# Altium project SW-RPi-CM3.PrjPcb
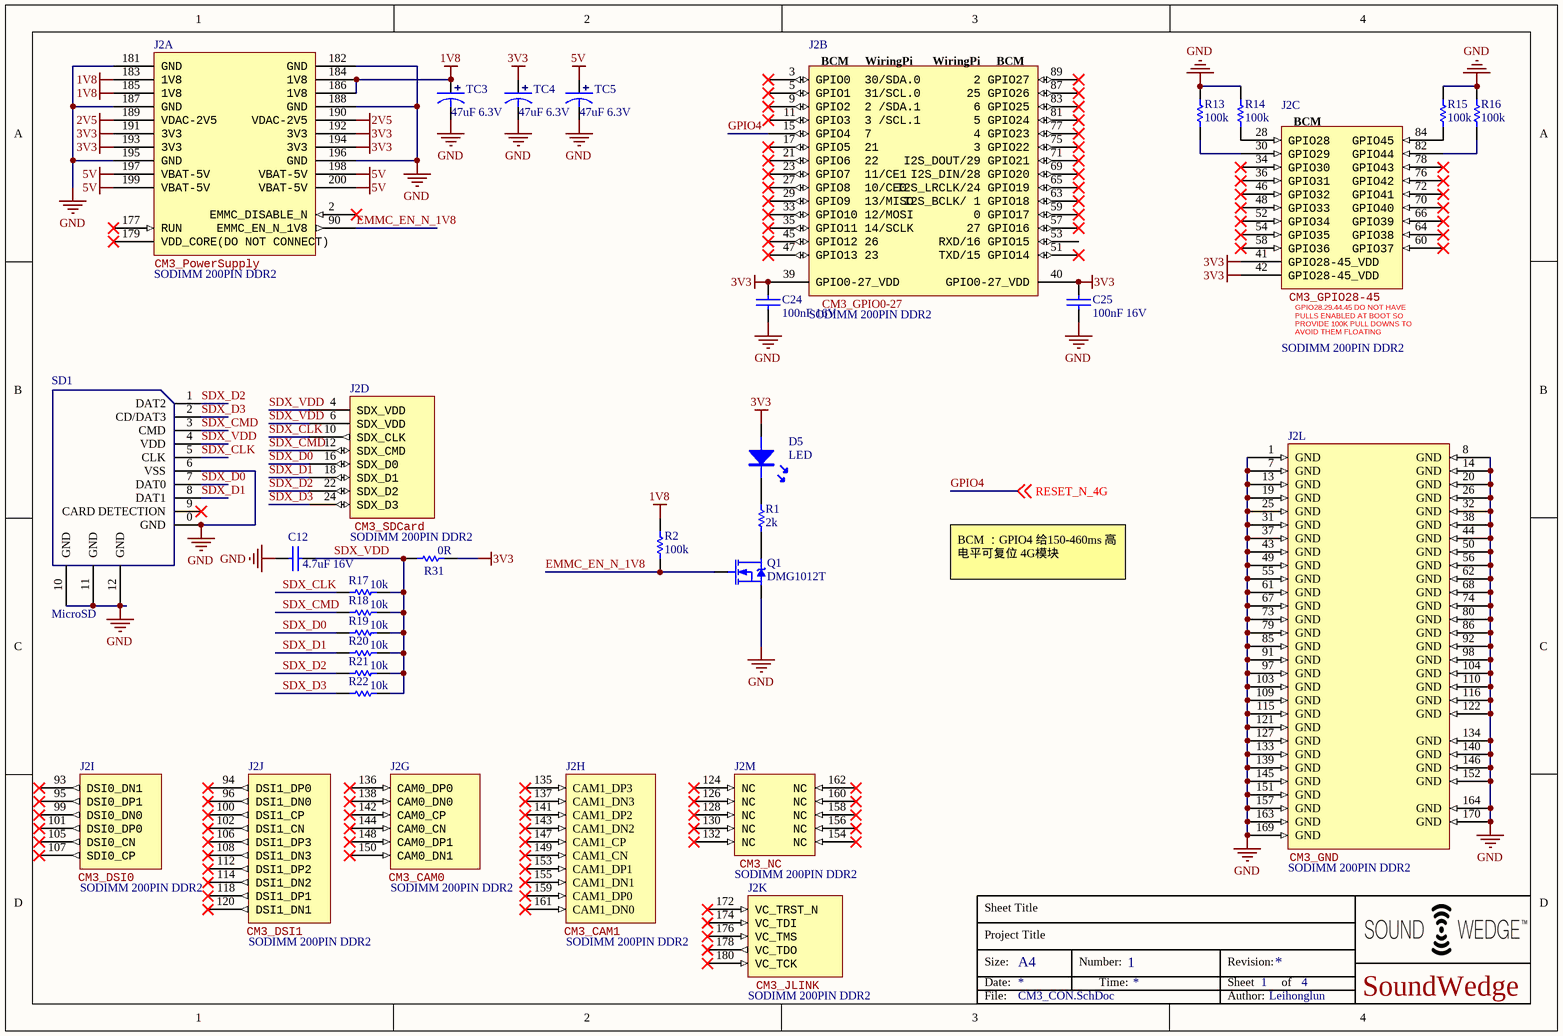
[diagram p0: CM3_CON.SchDoc]
PCB_Author: Author; PCB_Revision: V0I0; Project_Name: Templates Project; SCH_Author: LeiHongLun; SCH_Revision: V0I0; SCH_SheetTotal: 16
4 sheets, 83 parts. Net scope: global (net labels, ports and power ports of the same name join across sheets).
Board file: CM3_Board.PcbDoc
Sheets:
  CM3_CON.SchDoc
  CM3_HDMI.SchDoc
  CM3_Power.SchDoc
  CM3_USBHub.SchDoc

## Sheet CM3_CON.SchDoc: =DocumentName
size A4; Author: Leihonglun; CompanyName: SoundWedge; DocumentNumber: 1; SheetNumber: 1; SheetTotal: 4; SheetTitle: CM3_CON.SchDoc; ProjectTitle: SW-RPi-CM3.PrjPcb

### Parts
C12  4.7uF 16V  [0402C]
C24  100nF 16V  [0402C]
C25  100nF 16V  [0402C]
D5  LED  [LED-0603G]
J2  SODIMM 200PIN DDR2  [SODIMM 200PIN - 5.2H]  (parts A,B,C,D,G,H,I,J,K,L,M of 13)
Q1  DMG1012T  [SOT523]
R1  2k  [0402R]
R2  100k  [0402R]
R13  100k  [0402R]
R14  100k  [0402R]
R15  100k  [0402R]
R16  100k  [0402R]
R17  10k  [0402R]
R18  10k  [0402R]
R19  10k  [0402R]
R20  10k  [0402R]
R21  10k  [0402R]
R22  10k  [0402R]
R31  0R  [0402R]
SD1  MicroSD  [Micro SD]
TC3  47uF 6.3V  [TAJ-A/3216]
TC4  47uF 6.3V  [TAJ-A/3216]
TC5  47uF 6.3V  [TAJ-A/3216]

### Nets
1V8: J2.183(1V8) J2.184(1V8) J2.185(1V8) J2.186(1V8) R2.2 TC3.1
2V5: J2.189(VDAC-2V5) J2.190(VDAC-2V5)
3V3: C24.2 C25.2 D5.A J2.39(GPIO0-27_VDD) J2.40(GPIO0-27_VDD) J2.41(GPIO28-45_VDD) J2.42(GPIO28-45_VDD) J2.191(3V3) J2.192(3V3) J2.193(3V3) J2.194(3V3) R31.2 TC4.1
5V: J2.197(VBAT-5V) J2.198(VBAT-5V) J2.199(VBAT-5V) J2.200(VBAT-5V) TC5.1
GND: C12.1 C24.1 C25.1 J2.1(GND) J2.7(GND) J2.8(GND) J2.13(GND) J2.14(GND) J2.19(GND) J2.20(GND) J2.25(GND) J2.26(GND) J2.31(GND) J2.32(GND) J2.37(GND) J2.38(GND) J2.43(GND) J2.44(GND) J2.49(GND) J2.50(GND) J2.55(GND) J2.56(GND) J2.61(GND) J2.62(GND) J2.67(GND) J2.68(GND) J2.73(GND) J2.74(GND) J2.79(GND) J2.80(GND) J2.85(GND) J2.86(GND) J2.91(GND) J2.92(GND) J2.97(GND) J2.98(GND) J2.103(GND) J2.104(GND) J2.109(GND) J2.110(GND) J2.115(GND) J2.116(GND) J2.121(GND) J2.122(GND) J2.127(GND) J2.133(GND) J2.134(GND) J2.139(GND) J2.140(GND) J2.145(GND) J2.146(GND) J2.151(GND) J2.152(GND) J2.157(GND) J2.163(GND) J2.164(GND) J2.169(GND) J2.170(GND) J2.181(GND) J2.182(GND) J2.187(GND) J2.188(GND) J2.195(GND) J2.196(GND) Q1.S R13.2 R14.2 R15.2 R16.2 SD1.0(GND) SD1.6(VSS) SD1.10(GND) SD1.11(GND) SD1.12(GND) TC3.2 TC4.2 TC5.2
EMMC_EN_N_1V8: J2.90(EMMC_EN_N_1V8) Q1.G R2.1
GPIO4: J2.15(GPIO4__7) ; off-sheet RESET_N_4G  [also labelled RESET_N_4G]
SDX_CLK: J2.10(SDX_CLK) R17.1 SD1.5(CLK)
SDX_CMD: J2.12(SDX_CMD) R18.1 SD1.3(CMD)
SDX_D0: J2.16(SDX_D0) R19.1 SD1.7(DAT0)
SDX_D1: J2.18(SDX_D1) R20.1 SD1.8(DAT1)
SDX_D2: J2.22(SDX_D2) R21.1 SD1.1(DAT2)
SDX_D3: J2.24(SDX_D3) R22.1 SD1.2(CD/DAT3)
SDX_VDD: C12.2 J2.4(SDX_VDD) J2.6(SDX_VDD) R17.2 R18.2 R19.2 R20.2 R21.2 R22.2 R31.1 SD1.4(VDD)
NetD5_K: D5.K R1.1
NetJ2_28: J2.28(GPIO28) R14.1
NetJ2_30: J2.30(GPIO29) R13.1
NetJ2_82: J2.82(GPIO44) R16.1
NetJ2_84: J2.84(GPIO45) R15.1
NetQ1_D: Q1.D R1.2

Not connected (* = marked no-connect by the designer): J2 2(EMMC_DISABLE_N)* 3(GPIO0__30/SDA.0)* 5(GPIO1__31/SCL.0)* 9(GPIO2__2_/SDA.1)* 11(GPIO3__3_/SCL.1)* 17(GPIO5__21)* 21(GPIO6__22)* 23(GPIO7__11/CE1)* 27(GPIO8__10/CE0)* 29(GPIO9__13/MISO)* 33(GPIO10_12/MOSI)* 34(GPIO30)* 35(GPIO11_14/SCLK)* 36(GPIO31)* 45(GPIO12_26)* 46(GPIO32)* 47(GPIO13_23)* 48(GPIO33)* 51(TXD/15_GPIO14)* 52(GPIO34)* 53(RXD/16_GPIO15) 54(GPIO35)* 57(27_GPIO16)* 58(GPIO36)* 59(0_GPIO17)* 60(GPIO37)* 63(I2S_BCLK/_1_GPIO18)* 64(GPIO38)* 65(I2S_LRCLK/24_GPIO19)* 66(GPIO39)* 69(I2S_DIN/28_GPIO20)* 70(GPIO40)* 71(I2S_DOUT/29_GPIO21)* 72(GPIO41)* 75(3_GPIO22)* 76(GPIO42)* 77(4_GPIO23)* 78(GPIO43)* 81(5_GPIO24)* 83(6_GPIO25)* 87(25_GPIO26)* 89(2_GPIO27)* 93(DSI0_DN1)* 94(DSI1_DP0)* 95(DSI0_DP1)* 96(DSI1_DN0)* 99(DSI0_DN0)* 100(DSI1_CP)* 101(DSI0_DP0)* 102(DSI1_CN)* 105(DSI0_CN)* 106(DSI1_DP3)* 107(SDI0_CP)* 108(DSI1_DN3)* 112(DSI1_DP2)* 114(DSI1_DN2)* 118(DSI1_DP1)* 120(DSI1_DN1)* 124(NC)* 126(NC)* 128(NC)* 130(NC)* 132(NC)* 135(CAM1_DP3)* 136(CAM0_DP0)* 137(CAM1_DN3)* 138(CAM0_DN0)* 141(CAM1_DP2)* 142(CAM0_CP)* 143(CAM1_DN2)* 144(CAM0_CN)* 147(CAM1_CP)* 148(CAM0_DP1)* 149(CAM1_CN)* 150(CAM0_DN1)* 153(CAM1_DP1)* 154(NC)* 155(CAM1_DN1)* 156(NC)* 158(NC)* 159(CAM1_DP0)* 160(NC)* 161(CAM1_DN0)* 162(NC)* 172(VC_TRST_N)* 174(VC_TDI)* 176(VC_TMS)* 177(RUN)* 178(VC_TDO)* 179(VDD_CORE(DO_NOT_CONNECT))* 180(VC_TCK)*; SD1 9(CARD_DETECTION)*

### Notes on the sheet
- BCM ：GPIO4 给150-460ms 高电平可复位 4G模块
- Sheet Title
- Project Title
- Size:
- Date:
- A4
- Number:
- Time:
- Revision:
- Sheet
- of
- File:
- Author:
- (in symbol RPi-CM3, part A) CM3_PowerSupply
- (in symbol RPi-CM3, part B) BCM; WiringPi; CM3_GPIO0-27
- (in symbol RPi-CM3, part C) BCM; CM3_GPIO28-45; GPIO28.29.44.45 DO NOT HAVE PULLS ENABLED AT BOOT SO PROVIDE 100K PULL DOWNS TO AVOID THEM FLOATING
- (in symbol RPi-CM3, part D) CM3_SDCard
- (in symbol RPi-CM3, part G) CM3_CAM0
- (in symbol RPi-CM3, part H) CM3_CAM1
- (in symbol RPi-CM3, part I) CM3_DSI0
- (in symbol RPi-CM3, part J) CM3_DSI1
- (in symbol RPi-CM3, part K) CM3_JLINK
- (in symbol RPi-CM3, part L) CM3_GND
- (in symbol RPi-CM3, part M) CM3_NC

### Library data of the parts
C12 C24 C25 = CAP-NP
D5 = LED: 绿色
J2 = RPi-CM3
Q1 = N-MOS: N沟道场效应管
R1 R2 R13-R22 R31 = RES
SD1 = MicroSD: 佐田¦(自弹)TF卡座 micro sd卡座; ComponentLink1Description: taobao.com; ComponentLink1URL: https://detail.tmall.com/item.htm?id=44131369945&spm=a1z09.2.0.0.73b72e8dl9KedD&_u=am2gus40e9e
TC3-TC5 = TCAP

## Sheet CM3_HDMI.SchDoc
size A4; DocumentNumber: 2; SheetNumber: 2; SheetTotal: 4; SheetTitle: CM3_HDMI.SchDoc; ProjectTitle: SW-RPi-CM3.PrjPcb
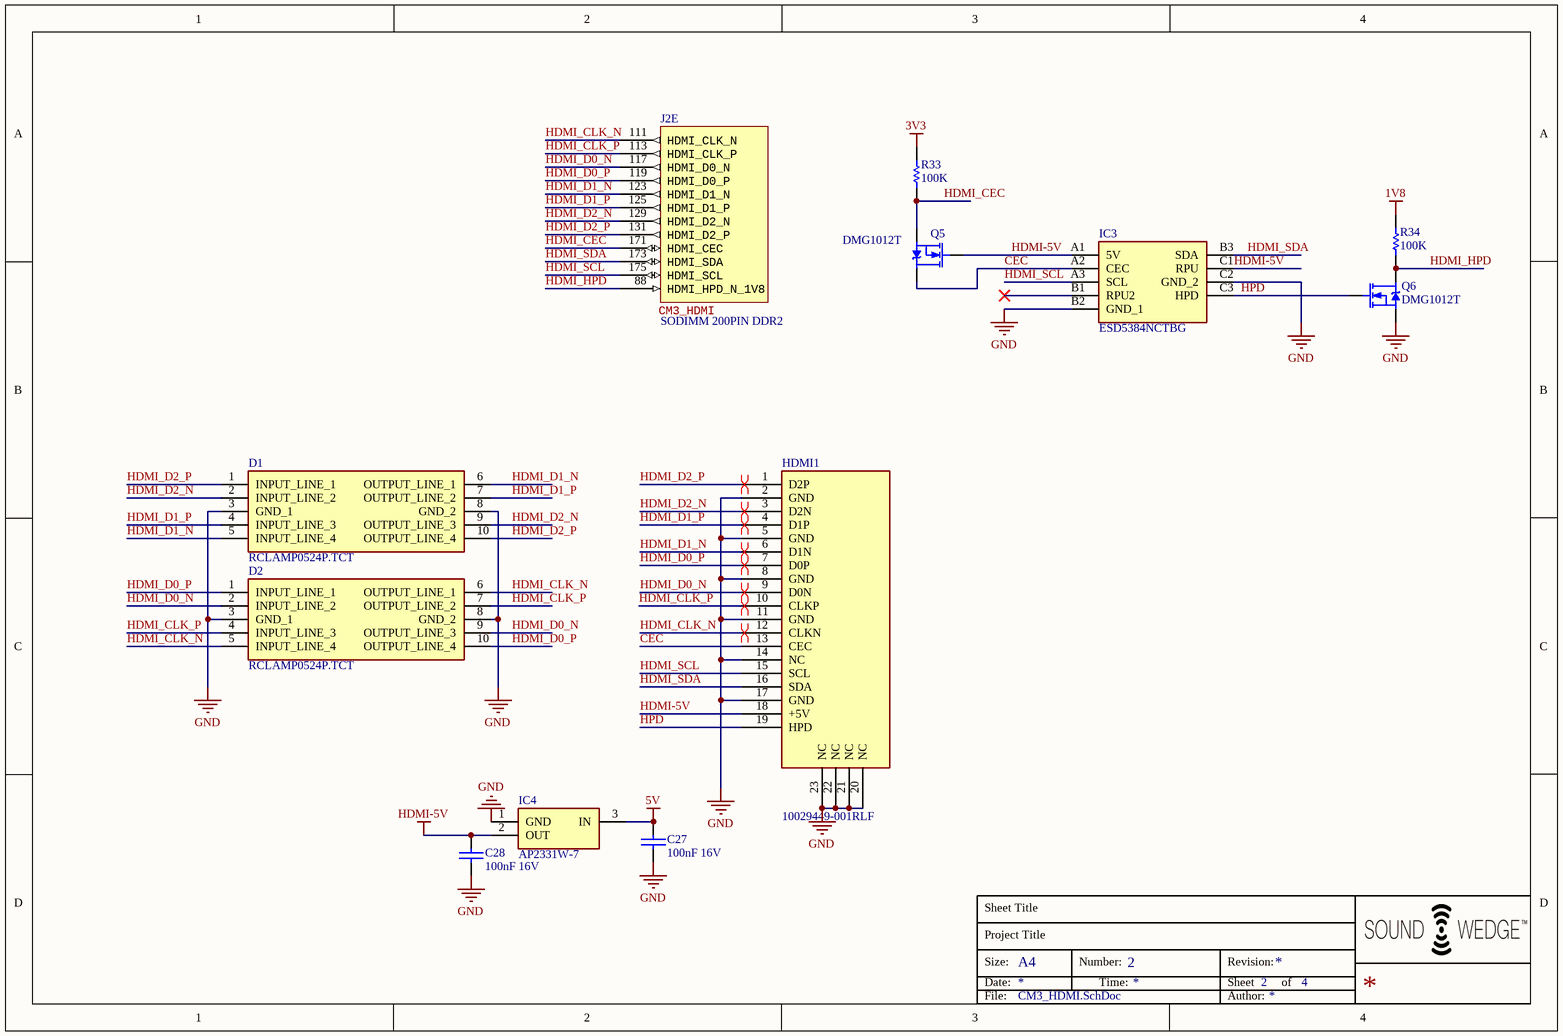
[diagram p1: CM3_HDMI.SchDoc]

### Parts
C27  100nF 16V  [0402C]
C28  100nF 16V  [0402C]
D1  RCLAMP0524P.TCT  [RCLAMP0524P]
D2  RCLAMP0524P.TCT  [RCLAMP0524P]
HDMI1  10029449-001RLF  [HDMI-001]
IC3  ESD5384NCTBG  [BGA9C40P3X3_114X114X63]
IC4  AP2331W-7  [SOT95P285X130-3N]
J2  SODIMM 200PIN DDR2  [SODIMM 200PIN - 5.2H]  (part E of 13)
Q5  DMG1012T  [SOT523]
Q6  DMG1012T  [SOT523]
R33  100K  [0402R]
R34  100K  [0402R]

### Nets
1V8: R34.2
3V3: R33.2
5V: C27.1 IC4.3(IN)
GND: C27.2 C28.2 D1.3(GND_1) D1.8(GND_2) D2.3(GND_1) D2.8(GND_2) HDMI1.2(GND) HDMI1.5(GND) HDMI1.8(GND) HDMI1.11(GND) HDMI1.14(NC) HDMI1.17(GND) HDMI1.20(NC) HDMI1.21(NC) HDMI1.22(NC) HDMI1.23(NC) IC3.B2(GND_1) IC3.C2(GND_2) IC4.1(GND) Q6.S
HDMI-5V: C28.1 HDMI1.18(+5V) IC3.A1(5V) IC3.C1(RPU) IC4.2(OUT) Q5.G
CEC: HDMI1.13(CEC) IC3.A2(CEC) Q5.D
HDMI_CEC: J2.171(HDMI_CEC) Q5.S R33.1
HDMI_CLK_N: D2.5(INPUT_LINE_4) D2.6(OUTPUT_LINE_1) HDMI1.12(CLKN) J2.111(HDMI_CLK_N)
HDMI_CLK_P: D2.4(INPUT_LINE_3) D2.7(OUTPUT_LINE_2) HDMI1.10(CLKP) J2.113(HDMI_CLK_P)
HDMI_D0_N: D2.2(INPUT_LINE_2) D2.9(OUTPUT_LINE_3) HDMI1.9(D0N) J2.117(HDMI_D0_N)
HDMI_D0_P: D2.1(INPUT_LINE_1) D2.10(OUTPUT_LINE_4) HDMI1.7(D0P) J2.119(HDMI_D0_P)
HDMI_D1_N: D1.5(INPUT_LINE_4) D1.6(OUTPUT_LINE_1) HDMI1.6(D1N) J2.123(HDMI_D1_N)
HDMI_D1_P: D1.4(INPUT_LINE_3) D1.7(OUTPUT_LINE_2) HDMI1.4(D1P) J2.125(HDMI_D1_P)
HDMI_D2_N: D1.2(INPUT_LINE_2) D1.9(OUTPUT_LINE_3) HDMI1.3(D2N) J2.129(HDMI_D2_N)
HDMI_D2_P: D1.1(INPUT_LINE_1) D1.10(OUTPUT_LINE_4) HDMI1.1(D2P) J2.131(HDMI_D2_P)
HDMI_HPD: J2.88(HDMI_HPD_N_1V8) Q6.D R34.1
HDMI_SCL: HDMI1.15(SCL) IC3.A3(SCL) J2.175(HDMI_SCL)
HDMI_SDA: HDMI1.16(SDA) IC3.B3(SDA) J2.173(HDMI_SDA)
HPD: HDMI1.19(HPD) IC3.C3(HPD) Q6.G

Not connected (* = marked no-connect by the designer): IC3 B1(RPU2)*

### Layout directives
differential pair: HDMI_CLK_N, HDMI_CLK_P, HDMI_D0_N, HDMI_D0_P, HDMI_D1_N, HDMI_D1_P, HDMI_D2_N, HDMI_D2_P

### Notes on the sheet
- Sheet Title
- Project Title
- Size:
- Date:
- A4
- Number:
- Time:
- Revision:
- Sheet
- of
- File:
- Author:
- (in symbol RPi-CM3, part E) CM3_HDMI

### Library data of the parts
C27 C28 = CAP
D1 D2 = RCLAMP0524P.TCT: Diode; Manufacturer_Name: SEMTECH; Datasheet Link: http://www.semtech.com/images/datasheet/rclamp0522p_0524p.pdf; Manufacturer_Part_Number: RCLAMP0524P.TCT; Arrow Part Number: RCLAMP0524P.TCT; Arrow Price/Stock: https://www.arrow.com/en/products/rclamp0524p.tct/semtech; Mouser Part Number: 947-RCLAMP0524P.TCT; Mouser Price/Stock: https://www.mouser.co.uk/ProductDetail/Semtech/RCLAMP0524PTCT?qs=rBWM4%252BvDhIdgSxIzr%252B4z8Q%3D%3D
HDMI1 = 10029449-001RLF: HDMI Connector; Manufacturer_Name: Amphenol; Allied_Number: 70247646; Datasheet Link: https://cdn.amphenol-icc.com/media/wysiwyg/files/drawing/10029449.pdf; Height: 6.3mm; Manufacturer_Part_Number: 10029449-001RLF; Mouser Part Number: 649-10029449-001RLF; Mouser Price/Stock: https://www.mouser.com/Search/Refine.aspx?Keyword=649-10029449-001RLF; RS Part Number: 7710094; RS Price/Stock: http://uk.rs-online.com/web/p/products/7710094; Allied Price/Stock: https://www.alliedelec.com/amphenolicc-10029449-001rlf/70247646/
IC3 = ESD5384NCTBG: Integrated Circuit; Manufacturer_Name: ON Semiconductor; Allied_Number: 70466034; Datasheet Link: http://www.onsemi.com/pub/Collateral/ESD5384-D.PDF; Height: 0.63mm; Manufacturer_Part_Number: ESD5384NCTBG; Mouser Part Number: 863-ESD5384NCTBG; Mouser Price/Stock: https://www.mouser.com/Search/Refine.aspx?Keyword=863-ESD5384NCTBG; RS Part Number: 8010213P; RS Price/Stock: http://uk.rs-online.com/web/p/products/8010213P; Allied Price/Stock: http://www.alliedelec.com/on-semiconductor-esd5384nctbg/70466034/
IC4 = AP2331W-7: Integrated Circuit; Manufacturer_Name: Diodes Inc.; Datasheet Link: https://componentsearchengine.com/Datasheets/1/AP2331W-7.pdf; Height: 1.3mm; Manufacturer_Part_Number: AP2331W-7; Mouser Part Number: 621-AP2331W-7; Mouser Price/Stock: https://www.mouser.com/Search/Refine.aspx?Keyword=621-AP2331W-7; RS Part Number: 8287665P; RS Price/Stock: http://uk.rs-online.com/web/p/products/8287665P
J2 = RPi-CM3
Q5 Q6 = N-MOS: N沟道场效应管
R33 R34 = RES

## Sheet CM3_Power.SchDoc: =DocumentName
size A4; Author: Leihonglun; CompanyName: SoundWedge; DocumentNumber: 3; SheetNumber: 3; SheetTotal: 4; SheetTitle: CM3_Power.SchDoc; ProjectTitle: SW-RPi-CM3.PrjPcb
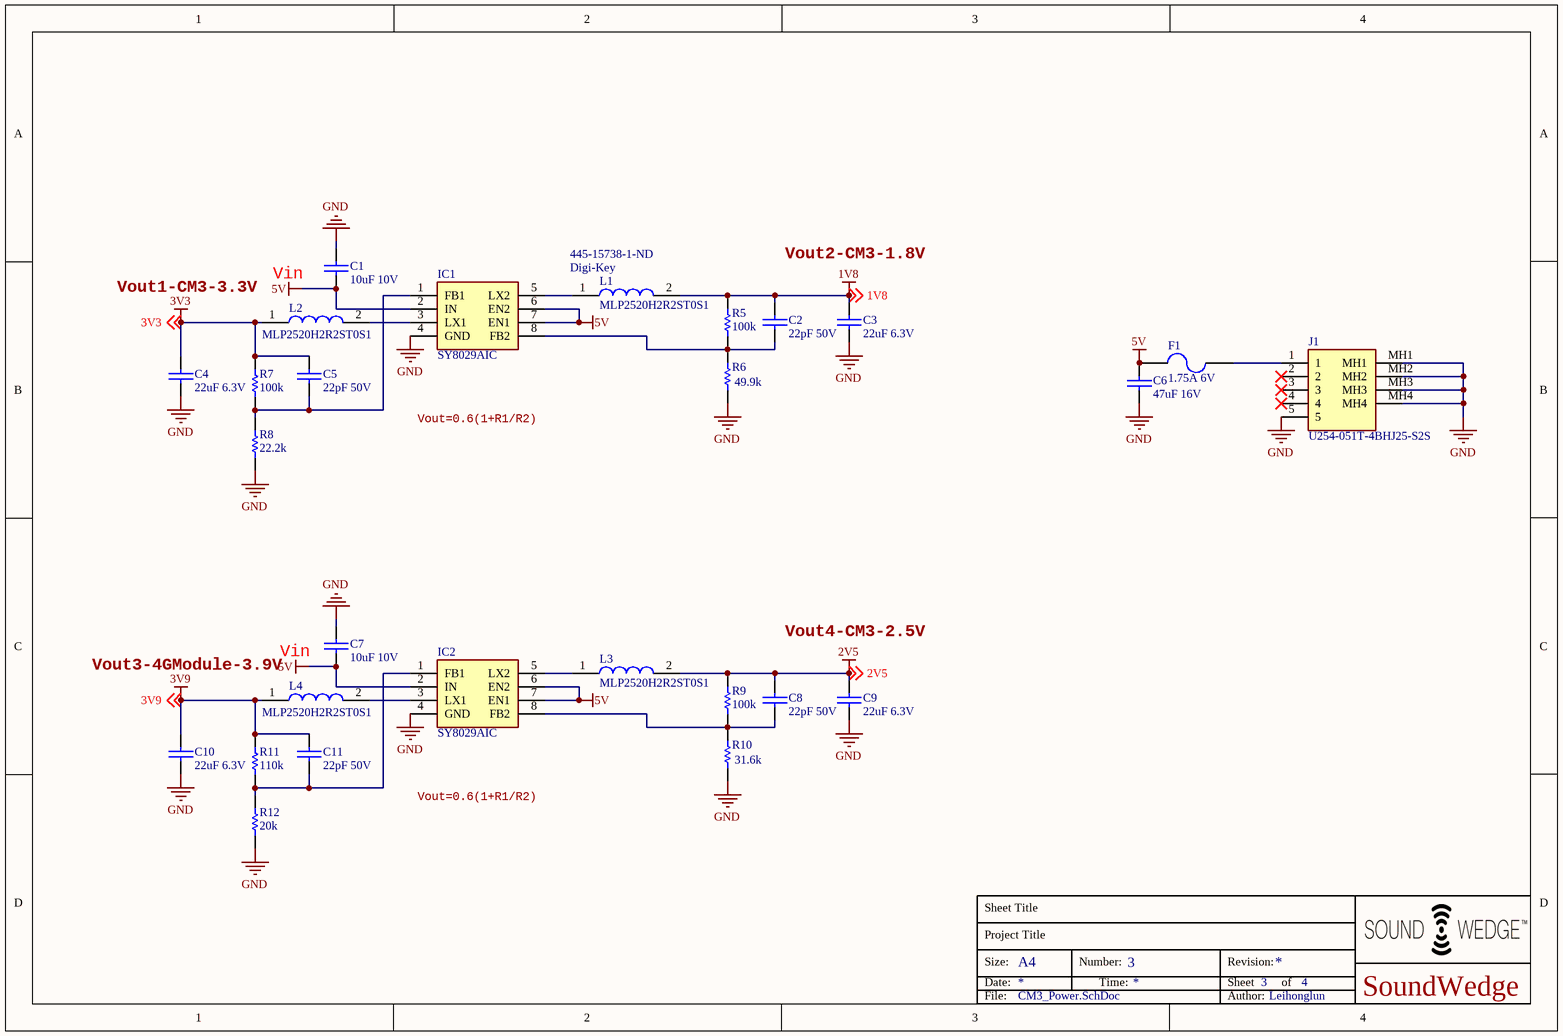
[diagram p2: CM3_Power.SchDoc]

### Parts
C1  10uF 10V  [0805C]
C2  22pF 50V  [0402C]
C3  22uF 6.3V  [0603C]
C4  22uF 6.3V  [0603C]
C5  22pF 50V  [0402C]
C6  47uF 16V  [1210C]
C7  10uF 10V  [0805C]
C8  22pF 50V  [0402C]
C9  22uF 6.3V  [0603C]
C10  22uF 6.3V  [0603C]
C11  22pF 50V  [0402C]
F1  1.75A 6V  [FUSE-1210]
IC1  SY8029AIC  [SOT65P280X110-8N]
IC2  SY8029AIC  [SOT65P280X110-8N]
J1  U254-051T-4BHJ25-S2S  [U254051T4BHJ25S2S]
L1  MLP2520H2R2ST0S1  Supplier 1: Digi-Key  Supplier Part Number 1: 445-15738-1-ND  [INDC2520X100N]
L2  MLP2520H2R2ST0S1  [INDC2520X100N]
L3  MLP2520H2R2ST0S1  [INDC2520X100N]
L4  MLP2520H2R2ST0S1  [INDC2520X100N]
R5  100k  [0402R]
R6  49.9k  [0402R]
R7  100k  [0402R]
R8  22.2k  [0402R]
R9  100k  [0402R]
R10  31.6k  [0402R]
R11  110k  [0402R]
R12  20k  [0402R]

### Nets
1V8: C2.2 C3.2 L1.2 R5.2 ; off-sheet 1V8
2V5: C8.2 C9.2 L3.2 R9.2 ; off-sheet 2V5
3V3: C4.2 C5.2 L2.1 R7.2 ; off-sheet 3V3
3V9: C10.2 C11.2 L4.1 R11.2 ; off-sheet 3V9
5V: C1.1 C6.2 C7.1 F1.1 IC1.2(IN) IC1.6(EN2) IC1.7(EN1) IC2.2(IN) IC2.6(EN2) IC2.7(EN1)
GND: C1.2 C3.1 C4.1 C6.1 C7.2 C9.1 C10.1 IC1.4(GND) IC2.4(GND) J1.5 J1.MH1 J1.MH2 J1.MH3 J1.MH4 R6.1 R8.1 R10.1 R12.1
NetC2_1: C2.1 IC1.8(FB2) R5.1 R6.2
NetC5_1: C5.1 IC1.1(FB1) R7.1 R8.2
NetC8_1: C8.1 IC2.8(FB2) R9.1 R10.2
NetC11_1: C11.1 IC2.1(FB1) R11.1 R12.2
NetF1_2: F1.2 J1.1
NetIC1_3: IC1.3(LX1) L2.2
NetIC1_5: IC1.5(LX2) L1.1
NetIC2_3: IC2.3(LX1) L4.2
NetIC2_5: IC2.5(LX2) L3.1

Not connected (* = marked no-connect by the designer): J1 2* 3* 4*

### Notes on the sheet
- Vout2-CM3-1.8V
- Vout1-CM3-3.3V
- Vin
- Vout=0.6(1+R1/R2)
- (near L4) Vout3-4GModule-3.9V
- Vout4-CM3-2.5V
- Sheet Title
- Project Title
- Size:
- Date:
- A4
- Number:
- Time:
- Revision:
- Sheet
- of
- File:
- Author:

### Library data of the parts
C1-C11 = CAP-NP
F1 = FUSE
IC1 IC2 = SY8029AIC: Integrated Circuit; Manufacturer_Name: Silergy Corp; Datasheet Link: https://datasheet.lcsc.com/szlcsc/Silergy-Corp-SY8029AIC_C207636.pdf; Height: 1.1mm; Manufacturer_Part_Number: SY8029AIC
J1 = U254-051T-4BHJ25-S2S: Connector; Manufacturer_Name: XKB Enterprise; Datasheet Link: https://datasheet.lcsc.com/szlcsc/2002271812_XKB-Enterprise-U254-051T-4BHJ25-S2S_C319163.pdf; Height: 2.9mm; Manufacturer_Part_Number: U254-051T-4BHJ25-S2S
L1-L4 = MLP2520K1R0MT0S1: Inductor; Manufacturer_Name: TDK; Datasheet Link: https://www.arrow.com/en/products/mlp2520k1r0mt0s1/tdk; Height: 1mm; Manufacturer_Part_Number: MLP2520K1R0MT0S1; Arrow Part Number: MLP2520K1R0MT0S1; Arrow Price/Stock: https://www.arrow.com/en/products/mlp2520k1r0mt0s1/tdk; Mouser Part Number: 810-MLP2520K1R0MT0S1; Mouser Price/Stock: https://www.mouser.com/Search/Refine.aspx?Keyword=810-MLP2520K1R0MT0S1
  L3: Parameter 1: *
R5-R12 = RES

## Sheet CM3_USBHub.SchDoc
size A4; DocumentNumber: 4; SheetNumber: 4; SheetTotal: 4; SheetTitle: 4; ProjectTitle: SW-RPi-CM3.PrjPcb
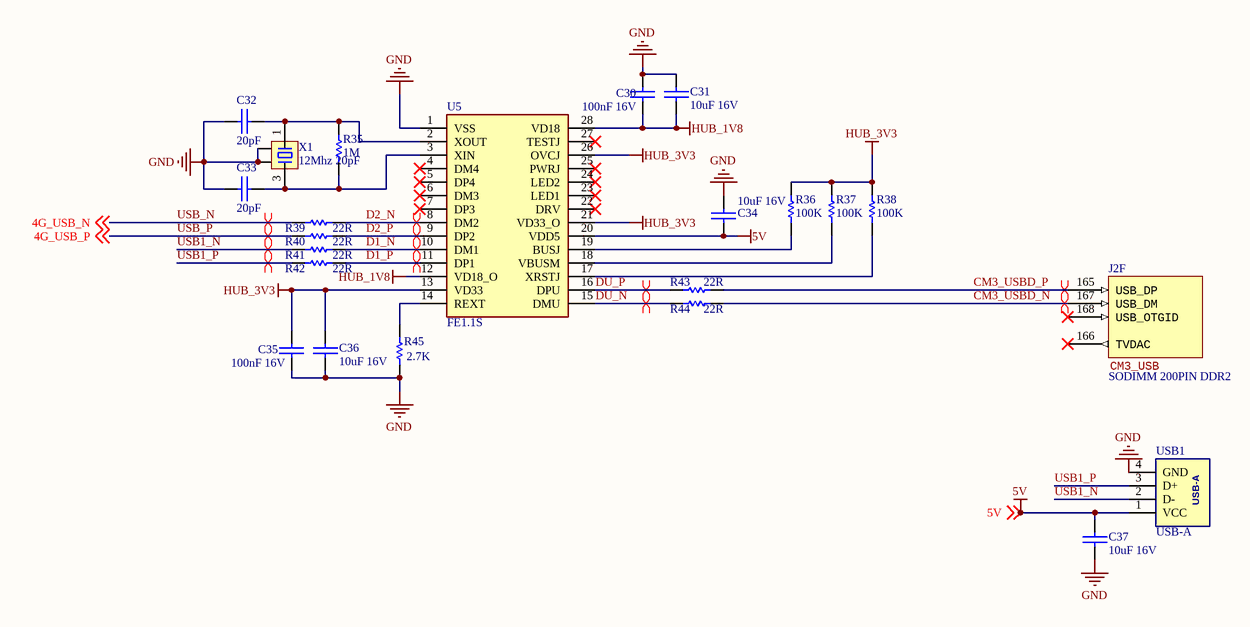
[diagram p3: CM3_USBHub.SchDoc]

### Parts
C30  100nF 16V  [0402C]
C31  10uF 16V  [0603C]
C32  20pF  [0402C]
C33  20pF  [0402C]
C34  10uF 16V  [0603C]
C35  100nF 16V  [0402C]
C36  10uF 16V  [0603C]
C37  10uF 16V  [0603C]
J2  SODIMM 200PIN DDR2  [SODIMM 200PIN - 5.2H]  (part F of 13)
R35  1M  [0402R]
R36  100K  [0402R]
R37  100K  [0402R]
R38  100K  [0402R]
R39  22R  [0402R]
R40  22R  [0402R]
R41  22R  [0402R]
R42  22R  [0402R]
R43  22R  [0402R]
R44  22R  [0402R]
R45  2.7K  [0402R]
U5  FE1.1S  [SOP64P600X175-28N]
USB1  USB-A  [USB_A/F-SMT]
X1  12Mhz 20pF  [OSC 3225-4P]

### Nets
5V: C34.2 C37.2 U5.20(VDD5) USB1.1(VCC) ; off-sheet 5V
GND: C30.2 C31.1 C32.2 C33.1 C34.1 C35.1 C36.2 C37.1 R45.1 U5.1(VSS) USB1.4(GND) X1.2 X1.4
HUB_1V8: C30.1 C31.2 U5.12(VD18_O) U5.28(VD18)
HUB_3V3: C35.2 C36.1 R36.2 R37.2 R38.2 U5.13(VD33) U5.21(VD33_O) U5.26(OVCJ)
CM3_USBD_N: J2.167(USB_DM) R44.1
CM3_USBD_P: J2.165(USB_DP) R43.1
D1_N: R41.1 U5.10(DM1)
D1_P: R42.1 U5.11(DP1)
D2_N: R39.1 U5.8(DM2)
D2_P: R40.1 U5.9(DP2)
DU_N: R44.2 U5.15(DMU)
DU_P: R43.2 U5.16(DPU)
USB1_N: R41.2 USB1.2(D-)
USB1_P: R42.2 USB1.3(D+)
USB_N: R39.2 ; off-sheet 4G_USB_N  [also labelled 4G_USB_N]
USB_P: R40.2 ; off-sheet 4G_USB_P  [also labelled 4G_USB_P]
NetC32_1: C32.1 R35.2 U5.2(XOUT) X1.1
NetC33_2: C33.2 R35.1 U5.3(XIN) X1.3
NetR36_1: R36.1 U5.19(BUSJ)
NetR37_1: R37.1 U5.18(VBUSM)
NetR38_1: R38.1 U5.17(XRSTJ)
NetR45_2: R45.2 U5.14(REXT)

Not connected (* = marked no-connect by the designer): J2 166(TVDAC)* 168(USB_OTGID)*; U5 4(DM4)* 5(DP4)* 6(DM3)* 7(DP3)* 22(DRV)* 23(LED1)* 24(LED2)* 25(PWRJ)* 27(TESTJ)*

### Layout directives
differential pair: CM3_USBD_N, CM3_USBD_P, D1_N, D1_P, D2_N, D2_P, DU_N, DU_P, USB1_N, USB1_P, USB_N, USB_P

### Notes on the sheet
- Sheet Title
- Project Title
- Size:
- Date:
- A4
- Number:
- Time:
- Revision:
- Sheet
- of
- File:
- Author:
- (in symbol RPi-CM3, part F) CM3_USB

### Library data of the parts
C30-C37 = CAP-NP
J2 = RPi-CM3
R35-R45 = RES
U5 = FE1.1S: Integrated Circuit; Manufacturer_Name: JFD IC; Datasheet Link: https://cdn-shop.adafruit.com/product-files/2991/FE1.1s+Data+Sheet+(Rev.+1.0).pdf; Height: 1.75mm; Manufacturer_Part_Number: FE1.1S
X1 = XTAL-4P

## Nets that join several sheets
1V8: CM3_CON (6 pins), CM3_HDMI (R34.2), CM3_Power (C2.2 C3.2 L1.2 R5.2)
2V5: CM3_CON (J2.189 J2.190), CM3_Power (C8.2 C9.2 L3.2 R9.2)
3V3: CM3_CON (13 pins), CM3_HDMI (R33.2), CM3_Power (C4.2 C5.2 L2.1 R7.2)
5V: CM3_CON (5 pins), CM3_HDMI (C27.1 IC4.3), CM3_Power (10 pins), CM3_USBHub (C34.2 C37.2 U5.20 USB1.1)
GND: CM3_CON (77 pins), CM3_HDMI (20 pins), CM3_Power (18 pins), CM3_USBHub (13 pins)